# EAGLE schematic FLUORO (EAGLE 7.3.0)
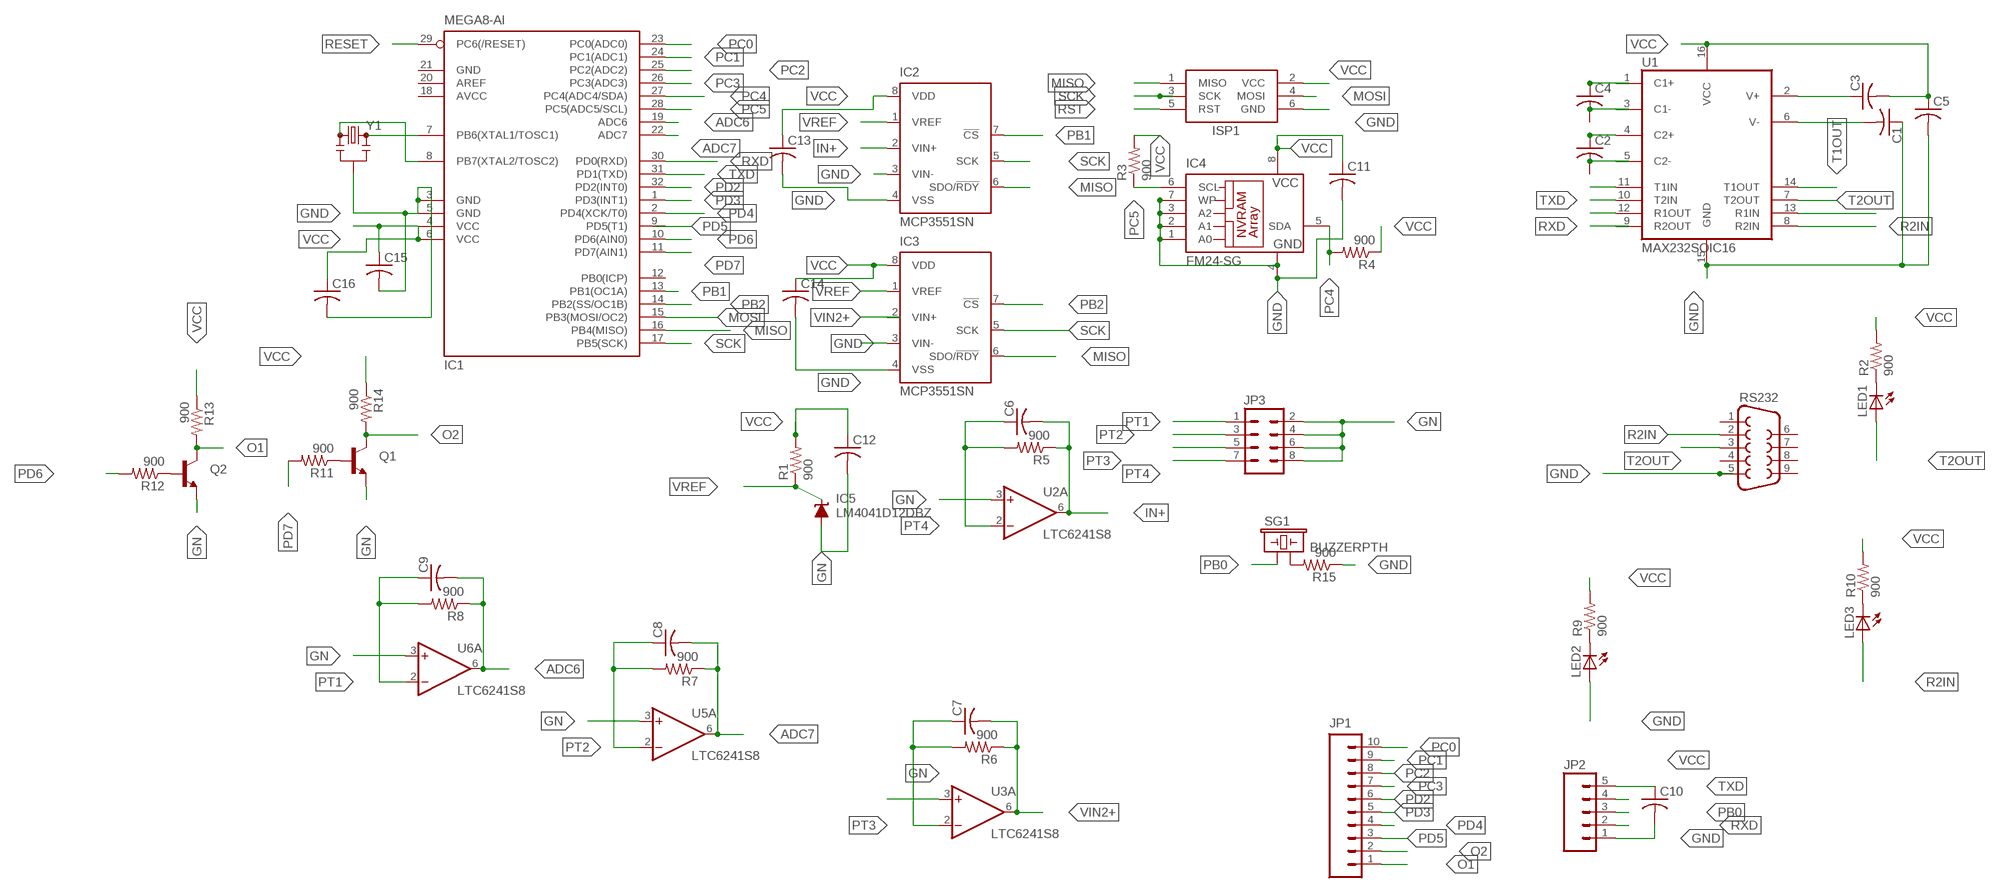
[diagram p0: schematic, sheet 1]

## Parts
C1  C-USC1206  [C1206]
C2  C-USC1206  [C1206]
C3  C-USC1206  [C1206]
C4  C-USC1206  [C1206]
C5  C-USC1206  [C1206]
C6  C-USC1206  [C1206]
C7  C-USC1206  [C1206]
C8  C-USC1206  [C1206]
C9  C-USC1206  [C1206]
C10  C-USC1206  [C1206]
C11  C-USC1206  [C1206]
C12  C-USC1206  [C1206]
C13  C-USC1206  [C1206]
C14  C-USC1206  [C1206]
C15  C-USC1206  [C1206]
C16  C-USC1206  [C1206]
IC1  MEGA8-AI  [TQFP32-08]
IC2  MCP3551SN  [SO-08]
IC3  MCP3551SN  [SO-08]
IC4  FM24-SG  [SO8]
IC5  LM4041D12DBZ  [DBZ_R-PDSO-G3]
ISP1  AVRISP-6  [AVRISP]
JP1  M10LOCK_LONGPADS  [1X10_LOCK_LONGPADS]
JP2  M05LOCK_LONGPADS  [1X05_LOCK_LONGPADS]
JP3  M04X2  [2X4]
LED1  LEDCHIPLED_0603  [CHIPLED_0603]
LED2  LEDCHIPLED_0603  [CHIPLED_0603]
LED3  LEDCHIPLED_0603  [CHIPLED_0603]
Q1  TRANSISTOR_NPN2N3904  [TO-92]
Q2  TRANSISTOR_NPN2N3904  [TO-92]
R1  900  R-US_M0805  [M0805]
R2  900  R-US_M0805  [M0805]
R3  900  R-US_M0805  [M0805]
R4  900  R-US_M0805  [M0805]
R5  900  R-US_M0805  [M0805]
R6  900  R-US_M0805  [M0805]
R7  900  R-US_M0805  [M0805]
R8  900  R-US_M0805  [M0805]
R9  900  R-US_M0805  [M0805]
R10  900  R-US_M0805  [M0805]
R11  900  R-US_M0805  [M0805]
R12  900  R-US_M0805  [M0805]
R13  900  R-US_M0805  [M0805]
R14  900  R-US_M0805  [M0805]
R15  900  R-US_M0805  [M0805]
RS232  DB9FEMALE  [DB9]
SG1  BUZZERPTH  [BUZZER-12MM]
U1  MAX232SOIC16  [SO016]
U2  LTC6241S8  [SO08]
U3  LTC6241S8  [SO08]
U5  LTC6241S8  [SO08]
U6  LTC6241S8  [SO08]
Y1  RESONATORPTH  [RESONATOR-PTH]

## Nets
ADC6: C9.2 IC1.19(ADC6) R8.1 U6.6(A:OUT)
ADC7: C8.2 IC1.22(ADC7) R7.1 U5.6(A:OUT)
GN: C12.2 IC5.2(A) JP3.2 JP3.4 JP3.6 JP3.8 Q1.1(E) Q2.1(E) U2.3(A:+IN) U3.3(A:+IN) U5.3(A:+IN) U6.3(A:+IN)
GND: C1.1 C5.2 C10.2 C11.2 C13.2 C14.2 C15.2 C16.2 IC1.3(GND) IC1.5(GND) IC2.3(VIN-) IC2.4(VSS) IC3.3(VIN-) IC3.4(VSS) IC4.4(GND) ISP1.6(GND) JP2.1 LED2.A R15.1 RS232.5 U1.15(GND) Y1.2
IN+: C6.2 IC2.2(VIN+) R5.1 U2.6(A:OUT)
MISO: IC1.16(PB4(MISO)) IC2.6(SDO/!RDY) ISP1.1(MISO)
MOSI: IC1.15(PB3(MOSI/OC2)) ISP1.4(MOSI)
N$1: LED1.C R2.1
N$2: LED2.C R9.1
N$3: C3.1 U1.2(V+)
N$4: C1.2 U1.6(V-)
N$5: IC4.1(A0) IC4.2(A1) IC4.3(A2) IC4.7(WP)
N$6: LED3.C R10.1
N$7: IC1.7(PB6(XTAL1/TOSC1)) Y1.3
N$8: IC1.8(PB7(XTAL2/TOSC2)) Y1.1
N$9: C4.1
N$11: C2.1 U1.4(C2+)
N$13: U1.11(T1IN)
N$14: R15.2 SG1.-
N$15: U1.12(R1OUT)
N$16: Q1.2(B) R11.1
N$18: Q2.2(B) R12.1
O1: JP1.1 Q2.3(C) R13.2
O2: JP1.2 Q1.3(C) R14.2
PB0: JP2.3 SG1.+
PB1: IC1.13(PB1(OC1A)) IC2.7(!CS)
PB2: IC1.14(PB2(SS/OC1B)) IC3.7(!CS)
PC0: IC1.23(PC0(ADC0)) JP1.10
PC1: IC1.24(PC1(ADC1)) JP1.9
PC2: IC1.25(PC2(ADC2)) JP1.8
PC3: IC1.26(PC3(ADC3)) JP1.7
PC4: IC1.27(PC4(ADC4/SDA)) IC4.5(SDA) R4.2
PC5: IC1.28(PC5(ADC5/SCL)) IC4.6(SCL) R3.1
PD2: IC1.32(PD2(INT0)) JP1.6
PD3: IC1.1(PD3(INT1)) JP1.5
PD4: IC1.2(PD4(XCK/T0)) JP1.4
PD5: JP1.3
PD6: IC1.10(PD6(AIN0)) R12.2
PD7: IC1.11(PD7(AIN1)) R11.2
PT1: C9.1 JP3.1 R8.2 U6.2(A:-IN)
PT2: C8.1 JP3.3 R7.2 U5.2(A:-IN)
PT3: C7.1 JP3.5 R6.2 U3.2(A:-IN)
PT4: C6.1 JP3.7 R5.2 U2.2(A:-IN)
R2IN: LED3.A RS232.2 U1.8(R2IN)
RESET: IC1.29(PC6(/RESET))
RST: ISP1.5(RST)
RXD: IC1.30(PD0(RXD)) JP2.2
SCK: IC1.17(PB5(SCK)) IC2.5(SCK) IC3.5(SCK) ISP1.3(SCK)
T1OUT: U1.14(T1OUT)
T2OUT: LED1.A RS232.3 U1.7(T2OUT) U1.13(R1IN)
TXD: IC1.31(PD1(TXD)) JP2.4 U1.10(T2IN)
VCC: C3.2 C5.1 C10.1 C11.1 C12.1 C13.1 C14.1 C15.1 C16.1 IC1.4(VCC) IC1.6(VCC) IC2.8(VDD) IC3.8(VDD) IC4.8(VCC) ISP1.2(VCC) JP2.5 R1.2 R2.2 R3.2 R4.1 R9.2 R10.2 R13.1 R14.1 U1.16(VCC)
VIN2+: C7.2 R6.1 U3.6(A:OUT)
VREF: IC2.1(VREF) IC3.1(VREF) IC5.1(C) R1.1
Unconnected: C2.2 C4.2 IC1.9(PD5(T1)) IC1.12(PB0(ICP)) IC1.20(AREF) IC3.2(VIN+) IC3.6(SDO/!RDY) RS232.1 RS232.4 RS232.6 RS232.7 RS232.8 RS232.9 U1.1(C1+) U1.3(C1-) U1.5(C2-) U1.9(R2OUT)

## Power pins joined to a net without a drawn wire
AVCC: IC1.18(AVCC)
GND: IC1.21(GND)
V+: U2.4(P:V+) U3.4(P:V+) U5.4(P:V+) U6.4(P:V+)
V-: U2.5(P:V-) U3.5(P:V-) U5.5(P:V-) U6.5(P:V-)

## Library data of the parts
C1-C16 = adafruit:C-US: CAPACITOR, American symbol
IC1 = atmel:MEGA8: MICROCONTROLLER 8 Kbytes FLASH, 1 kbytes SRAM, 512 bytes EEPROM, USART, 6-channel 10 bit ADC, 2-channel 8 bit ADC Pin compatible with Atmega48, ATMega88, ATMega168 Source: avr.lbr; MPN: ATMEGA8-16AU; OC_FARNELL: 9171371; OC_NEWARK: 73M8863
IC2 IC3 = microchip:MCP355*: Low-Power, Single-Channel 22-Bit Delta-Sigma ADCs Source: http://ww1.microchip.com/downloads/en/DeviceDoc/21950c.pdf; MPN: MCP3551-E/SN; OC_FARNELL: 1084625; OC_NEWARK: 97K4494
IC4 = ramtron:FM24*: I2C NVRAM 8 pin
IC5 = texas:LM4041: PRECISION MICROPOWER SHUNT VOLTAGE REFERENCE Source: http://focus.ti.com/lit/ds/slcs146e/slcs146e.pdf; MF: TEXAS INSTRUMENT CONNECTORS; MPN: LM4041D12QDBZT; OC_FARNELL: 1755118; OC_NEWARK: 43K3381
ISP1 = adafruit:AVRISP: AVR ISP HEADER Standard 6 pin header for AVR programming
JP1 = SparkFun-Connectors:M10: Header 10 Standard 10-pin 0.1" header. Use with straight break away headers (SKU : PRT-00116), right angle break away headers (PRT-00553), swiss pins (PRT-00743), machine pins (PRT-00117), and female headers (PRT-00115).
JP2 = SparkFun-Connectors:M05: Header 5 Standard 5-pin 0.1" header. Use with straight break away headers (SKU : PRT-00116), right angle break away headers (PRT-00553), swiss pins (PRT-00743), machine pins (PRT-00117), and female headers (PRT-00115). Molex polarized connector foot print use with SKU : PRT-08230 with associated crimp pins and housings.
JP3 = SparkFun-Connectors:M04X2: .1" header, two rows of four.
LED1-LED3 = adafruit:LED: LED OSRAM: - CHIPLED LG R971, LG N971, LY N971, LG Q971, LY Q971, LO R971, LY R971 LH N974, LH R974 LS Q976, LO Q976, LY Q976 LO Q996 - Hyper CHIPLED LW Q18S LB Q993, LB Q99A, LB R99A - SideLED LS A670, LO A670, LY A670, LG A670, LP A670 LB A673, LV A673, LT A673, LW A673 LH A674 LY A675 LS A676, LA A676, LO A676, LY A676, LW A676 LS A679, LY A679, LG A679 - Hyper Micro SIDELED® LS Y876, LA Y876, LO Y876, LY Y876 LT Y87S - SmartLED LW L88C, LW L88S LB L89C, LB L89S, LG L890 LS L89K, LO L89K, LY L89K LS L896, LA L896, LO L896, LY L896 - TOPLED LS T670, LO T670, LY T670, LG T670, LP T670 LSG T670, LSP T670, LSY T670, LOP T670, LYG T670 LG T671, LOG T671, LSG T671 LB T673, LV T673, LT T673, LW T673 LH T674 LS T676, LA T676, LO T676, LY T676, LB T676, LH T676, LSB T676, LW T676 LB T67C, LV T67C, LT T67C, LS T67K, LO T67K, LY T67K, LW E67C LS E67B, LA E67B, LO E67B, LY E67B, LB E67C, LV E67C, LT E67C LW T67C LS T679, LY T679, LG T679 LS T770, LO T770, LY T770, LG T770, LP T770 LB T773, LV T773, LT T773, LW T773 LH T774 LS E675, LA E675, LY E675, LS T675 LS T776, LA T776, LO T776, LY T776, LB T776 LHGB T686 LT T68C, LB T68C - Hyper Mini TOPLED® LB M676 - Mini TOPLED Santana® LG M470 LS M47K, LO M47K, LY M47K Source: http://www.osram.convergy.de/
Q1 Q2 = SparkFun-DiscreteSemi:TRANSISTOR_NPN: Generic NPN BJT MMBT2222A - TRANS-08049 (SOT-23, 1A 40V) MPSA42 - TRANS-09116 (SOT-23, 500mA 300V) MMBT5088LT1G - TRANS-11160 (SOT-23, 50 mA 30V) BC547 - COM-08928 <http://www.sparkfun.com/products/8928> (TO-92 45V 100mA) (1.Collector 2.Base 3.Emitter) 2N3904 - COM-00521 <http://www.sparkfun.com/products/521> (TO-92 40V 200mA) (1.Emitter 2.Base 3.Collector) P2N2222A - COM-12852 <http://www.sparkfun.com/products/12852> (TO-92 40V 600mA) (1.Collector 2.Base 3.Emitter); PROD_ID: TRANS-08447
R1-R15 = resistor:R-US_: RESISTOR, American symbol
RS232 = SparkFun-Connectors:DB9: DB9 Connector Standard DB9 (D-Sub 9) serial connector. Can be used for CAN bus as well as RS485 and RS232. Footprint production proven. Spark Fun Electronics SKU : PRT-00429; PROD_ID: CONN-08194
SG1 = SparkFun-Electromechanical:BUZZER: Buzzer 12mm Spark Fun Electronics SKU : Comp-Buzzer
U1 = SparkFun-DigitalIC:MAX232: RS232 Transceiver Very common IC. This is generically called 'MAX232', but works with the 3V equivalent MAX3232 generic ICs. Field tested and mother approved. Spark Fun Electronics SKU : COM-00316 (DIP) and COM-00589 (SMD); PROD_ID: IC-08171
U2 U3 U5 U6 = linear-technology:LTC6241: OP AMP - CMOS 18MHz, Low Noise, Rail-to-Rail Output,
Y1 = SparkFun-FreqCtrl:RESONATOR: Resonator Small SMD resonator. Used, eg, on the Arduino Pro/ Pro Mini boards. 8MHz- XTAL-08895 16MHz- XTAL-08900